# Altium schematic sheet 1_P1.schdoc
size 429 x 307 mm; Symbol: Drawing-Symbol_A3; Device: Drawing-Symbol_A3; Company: 嘉立创EDA; Version: V1.0; Page Size: A3; @Project Name: TUSB4020BPHP; @Page Count: 2; @Update Date: 2025-04-17; @Create Date: 2025-04-11; @Schematic Name: Schematic1; @Page No: 1; @Page Name: P1; @Create Time: 02:40:08; @Update Time: 20:53:57; Width: 1655; Height: 1170; Region Start: 1; X Region Count: 6; Y Region Count: 4; Blade Width: 10; Title Block Position: 3; @Board Name: Board1; SheetNumber: 1; SheetTotal: 2
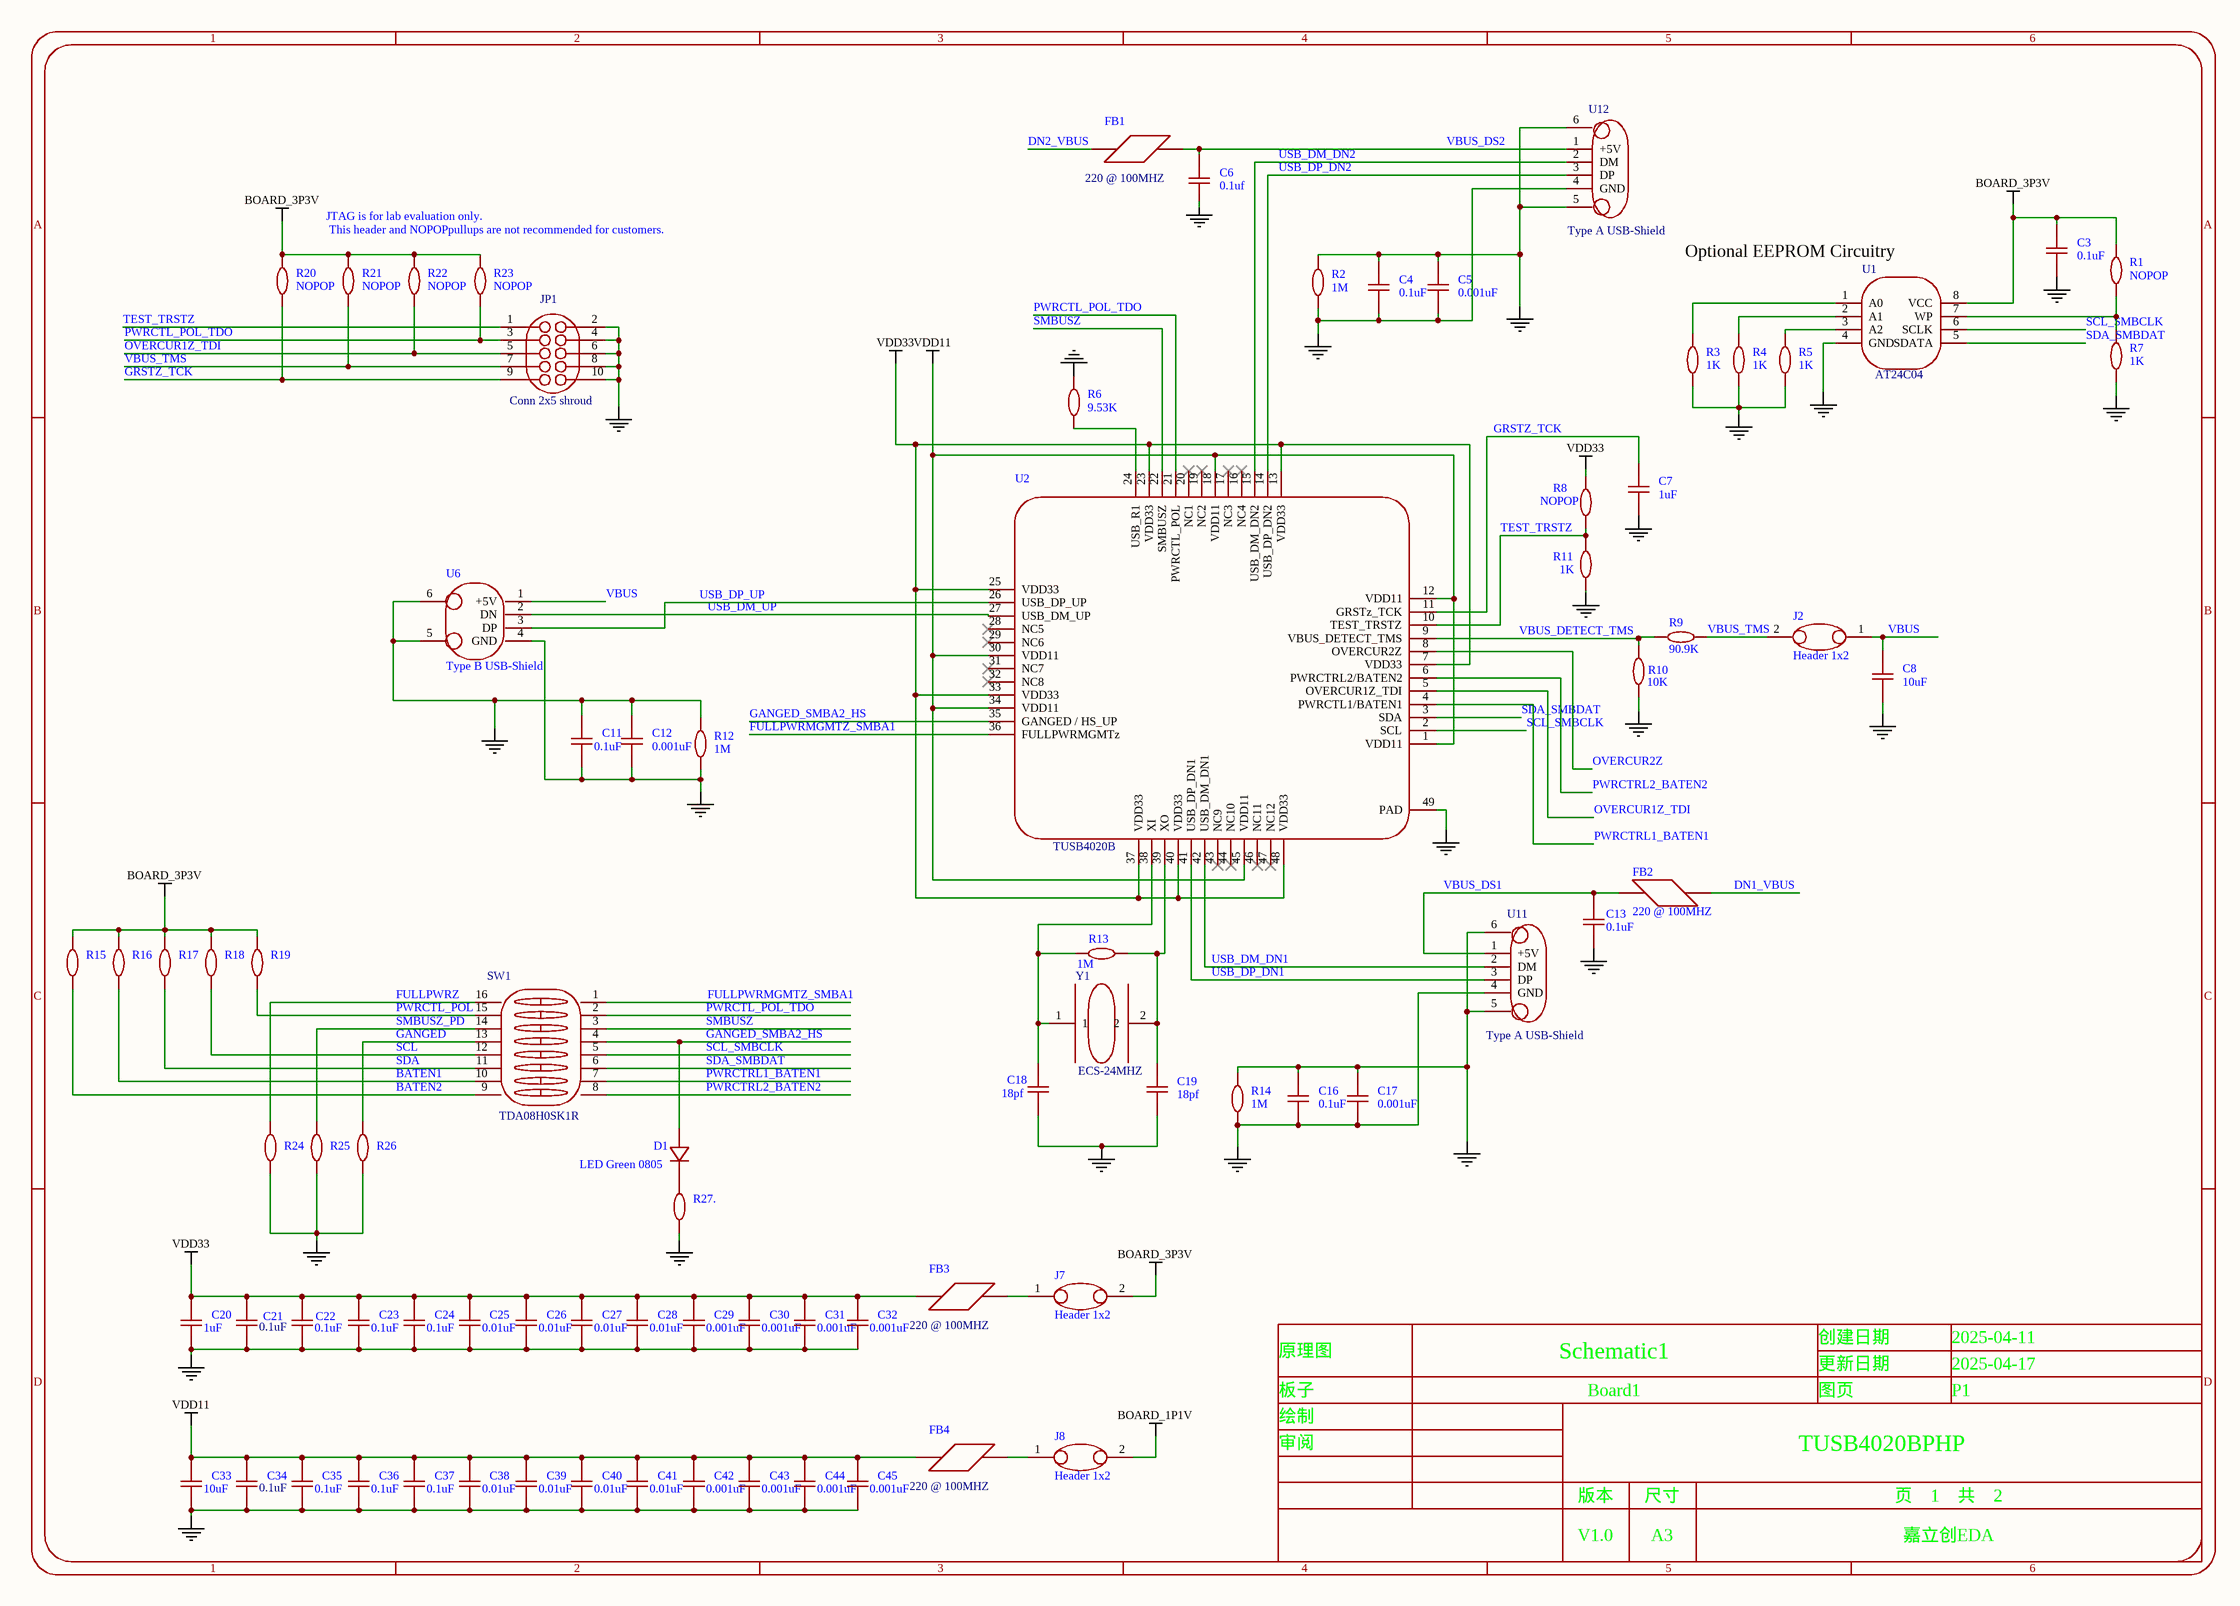
[diagram p0: 1_P1.schdoc]

## Parts
C3  0.1uF  [C0603]
C4  0.1uF  [C0603]
C5  0.001uF  [C0603]
C6  0.1uf  [C0603]
C7  1uF  [C0603]
C8  10uF  [C0603]
C11  0.1uF  [C0603]
C12  0.001uF  [C0603]
C13  0.1uF  [C0603]
C16  0.1uF  [C0603]
C17  0.001uF  [C0603]
C18  18pf  [C0603]
C19  18pf  [C0603]
C20  1uF  [C0603]
C21  0.1uF  [C0603]
C22  0.1uF  [C0603]
C23  0.1uF  [C0603]
C24  0.1uF  [C0603]
C25  0.01uF  [C0603]
C26  0.01uF  [C0603]
C27  0.01uF  [C0603]
C28  0.01uF  [C0603]
C29  0.001uF  [C0603]
C30  0.001uF  [C0603]
C31  0.001uF  [C0603]
C32  0.001uF  [C0603]
C33  10uF  [C0603]
C34  0.1uF  [C0603]
C35  0.1uF  [C0603]
C36  0.1uF  [C0603]
C37  0.1uF  [C0603]
C38  0.01uF  [C0603]
C39  0.01uF  [C0603]
C40  0.01uF  [C0603]
C41  0.01uF  [C0603]
C42  0.001uF  [C0603]
C43  0.001uF  [C0603]
C44  0.001uF  [C0603]
C45  0.001uF  [C0603]
D1  LED Green 0805  [LED_0805]
FB1  (no value)  [L0805]
FB2  (no value)  [L0805]
FB3  (no value)  [L0805]
FB4  (no value)  [L0805]
J2  (no value)  [J2,J7,J8]
J7  (no value)  [J2,J7,J8]
J8  (no value)  [J2,J7,J8]
JP1  (no value)  [JP1]
R1  NOPOP  [R0603]
R2  1M  [R0603]
R3  1K  [R0603]
R4  1K  [R0603]
R5  1K  [R0603]
R6  9.53K  [R0603]
R7  1K  [R0603]
R8  NOPOP  [R0603]
R9  90.9K  [R0603]
R10  10K  [R0603]
R11  1K  [R0603]
R12  1M  [R0603]
R13  1M  [R0603]
R14  1M  [R0603]
R15  (no value)  [R0603]
R16  (no value)  [R0603]
R17  (no value)  [R0603]
R18  (no value)  [R0603]
R19  (no value)  [R0603]
R20  NOPOP  [R0603]
R21  NOPOP  [R0603]
R22  NOPOP  [R0603]
R23  NOPOP  [R0603]
R24  (no value)  [R0603]
R25  (no value)  [R0603]
R26  (no value)  [R0603]
R27.  (no value)  [R0603]
SW1  (no value)  [SW1]
U1  (no value)  [U1]
U2  (no value)  [U2]
U6  (no value)  [U6]
U11  (no value)  [U11,U12]
U12  (no value)  [U11,U12]
Y1  (no value)  [Y1]

## Nets
BOARD_1P1V: J8.2
BOARD_3P3V: C3.2 J7.2 R1.2 R15.1 R16.1 R17.1 R18.2 R19.2 R20.2 R21.2 R22.2 R23.2 U1.8(VCC)
GND: C3.1 C4.1 C4.2 C5.1 C5.2 C6.1 C7.1 C8.1 C11.1 C11.2 C12.1 C12.2 C13.1 C16.1 C16.2 C17.1 C17.2 C18.1 C19.1 C20.1 C21.1 C22.1 C23.1 C24.1 C25.1 C26.1 C27.1 C28.1 C29.1 C30.1 C31.1 C32.1 C33.1 C34.1 C35.1 C36.1 C37.1 C38.1 C39.1 C40.1 C41.1 C42.1 C43.1 C44.1 C45.1 JP1.2 JP1.4 JP1.6 JP1.8 JP1.10 R2.1 R2.2 R3.2 R4.1 R5.1 R6.2 R7.1 R10.2 R11.2 R12.1 R12.2 R14.1 R14.2 R24.2 R25.1 R26.1 R27..2 U1.4(GND) U2.49(PAD) U6.4(GND) U6.5 U6.6 U11.4(GND) U11.5 U11.6 U12.4(GND) U12.5 U12.6
VDD11: C33.2 C34.2 C35.2 C36.2 C37.2 C38.2 C39.2 C40.2 C41.2 C42.2 C43.2 C44.2 C45.2 FB4.2 U2.1(VDD11) U2.12(VDD11) U2.18(VDD11) U2.30(VDD11) U2.34(VDD11) U2.45(VDD11)
VDD33: C20.2 C21.2 C22.2 C23.2 C24.2 C25.2 C26.2 C27.2 C28.2 C29.2 C30.2 C31.2 C32.2 FB3.2 R8.1 U2.7(VDD33) U2.13(VDD33) U2.23(VDD33) U2.25(VDD33) U2.33(VDD33) U2.37(VDD33) U2.40(VDD33) U2.48(VDD33)
BATEN1: R16.2 SW1.10
BATEN2: R15.2 SW1.9
DN1_VBUS: FB2.2
DN2_VBUS: FB1.2
FULLPWRMGMTZ_SMBA1: SW1.1 U2.36(FULLPWRMGMTz)
FULLPWRZ: R24.1 SW1.16
GANGED: R26.2 SW1.13
GANGED_SMBA2_HS: D1.2(A) SW1.4 U2.35(GANGED_/_HS_UP)
GRSTZ_TCK: C7.2 JP1.9 R20.1 U2.11(GRSTz_TCK)
OVERCUR1Z_TDI: JP1.5 R22.1 U2.5(OVERCUR1Z_TDI)
OVERCUR2Z: U2.8(OVERCUR2Z)
PWRCTL_POL: R19.1 SW1.15
PWRCTL_POL_TDO: JP1.3 R23.1 SW1.2 U2.21(PWRCTL_POL)
PWRCTRL1_BATEN1: SW1.7 U2.4(PWRCTL1/BATEN1)
PWRCTRL2_BATEN2: SW1.8 U2.6(PWRCTRL2/BATEN2)
SCL: R18.1 SW1.12
SCL_SMBCLK: SW1.5 U1.6(SCLK) U2.2(SCL)
SDA: R17.2 SW1.11
SDA_SMBDAT: SW1.6 U1.5(SDATA) U2.3(SDA)
SMBUSZ: SW1.3 U2.22(SMBUSZ)
SMBUSZ_PD: R25.2 SW1.14
TEST_TRSTZ: JP1.1 R8.2 R11.1 U2.10(TEST_TRSTZ)
USB_DM_DN1: U2.42(USB_DM_DN1) U11.2(DM)
USB_DM_DN2: U2.15(USB_DM_DN2) U12.2(DM)
USB_DM_UP: U2.27(USB_DM_UP) U6.2(DN)
USB_DP_DN1: U2.41(USB_DP_DN1) U11.3(DP)
USB_DP_DN2: U2.14(USB_DP_DN2) U12.3(DP)
USB_DP_UP: U2.26(USB_DP_UP) U6.3(DP)
VBUS: C8.2 J2.1 U6.1(+5V)
VBUS_DETECT_TMS: R9.1 R10.1 U2.9(VBUS_DETECT_TMS)
VBUS_DS1: C13.2 FB2.1 U11.1(+5V)
VBUS_DS2: C6.2 FB1.1 U12.1(+5V)
VBUS_TMS: J2.2 JP1.7 R9.2 R21.1
NetC18_2: C18.2 R13.2 U2.38(XI) Y1.1
NetC19_2: C19.2 R13.1 U2.39(XO) Y1.2
NetD1_1: D1.1(K) R27..1
NetFB3_1: FB3.1 J7.1
NetFB4_1: FB4.1 J8.1
NetR1_1: R1.1 R7.2 U1.7(WP)
NetR3_1: R3.1 U1.1(A0)
NetR4_2: R4.2 U1.2(A1)
NetR5_2: R5.2 U1.3(A2)
NetR6_1: R6.1 U2.24(USB_R1)

Not connected (* = marked no-connect by the designer): U2 16(NC4)* 17(NC3)* 19(NC2)* 20(NC1)* 28(NC5)* 29(NC6)* 31(NC7)* 32(NC8)* 43(NC9)* 44(NC10)* 46(NC11)* 47(NC12)*

## Notes on the sheet
- (near U1) Optional EEPROM Circuitry
- JTAG is for lab evaluation only.
  This header and NOPOPpullups are not recommended for customers.
- 1
- 2
- 3
- 4
- 5
- 6
- A
- B
- C
- 原理图
- Schematic1
- 创建日期
- 更新日期
- 2025-04-11
- 2025-04-17
- D
- 板子
- 绘制
- Board1
- 图页
- P1
- 审阅
- 版本
- 尺寸
- TUSB4020BPHP
- 页    1    共    2
- V1.0
- A3
- 嘉立创EDA
- (in symbol tusb4020b) TUSB4020B

## Library data of the parts
C3-C8 C11-C13 C16-C45 = CAP_0603: Symbol: CapAcitance; Convert to PCB: yes; Device: CAP_0603; Add into BOM: yes; Supplier Footprint: 0603
  C3 C4 C11 C13 C16 C21-C24 C34-C37: Value: 0.1uF
  C5 C12 C17 C29-C32 C42-C45: Value: 0.001uF
  C6: Value: 0.1uf
  C7 C20: Value: 1uF
  C8 C33: Value: 10uF
  C18 C19: Value: 18pf
  C25-C28 C38-C41: Value: 0.01uF
D1 = D_1N4007A: Add into BOM: yes; Symbol: D_1N4007; Device: D_1N4007A; Supplier Footprint: DO-41; Convert to PCB: yes
FB1-FB4 = 220 @ 100MHZ: Add into BOM: yes; Symbol: 220 @ 100MHZ; Device: 220 @ 100MHZ; Convert to PCB: yes
J2 J7 J8 = Header 1x2: Add into BOM: yes; Symbol: Header 1x2; Device: Header 1x2; Convert to PCB: yes
JP1 = Conn 2x5 shroud: Add into BOM: yes; Symbol: Conn 2x5 shroud; Device: Conn 2x5 shroud; Convert to PCB: yes
R1-R26 R27. = Res_0603: Symbol: 电阻; Convert to PCB: yes; Device: Res_0603; Add into BOM: yes; Supplier Footprint: 0603
  R1 R8 R20-R23: Value: NOPOP
  R2 R12-R14: Value: 1M
  R3-R5 R7 R11: Value: 1K
  R6: Value: 9.53K
  R9: Value: 90.9K
  R10: Value: 10K
SW1 = TDA08H0SK1R: Add into BOM: yes; Symbol: TDA08H0SK1R; Device: TDA08H0SK1R; Convert to PCB: yes
U1 = AT24C04: Add into BOM: yes; Symbol: AT24C04; Device: AT24C04; Convert to PCB: yes
U2 = tusb4020b: Add into BOM: yes; Symbol: tusb4020b; Device: tusb4020b; Convert to PCB: yes
U6 = Type B USB-Shield: Add into BOM: yes; Symbol: Type B USB-Shield; Device: Type B USB-Shield; Convert to PCB: yes
U11 U12 = Type A USB-Shield: Add into BOM: yes; Symbol: Type A USB-Shield; Device: Type A USB-Shield; Convert to PCB: yes
Y1 = ECS-24MHZ: Add into BOM: yes; Symbol: ECS-24MHZ; Device: ECS-24MHZ; Convert to PCB: yes